# Altium project Power_electronics_FULL.PrjPcb
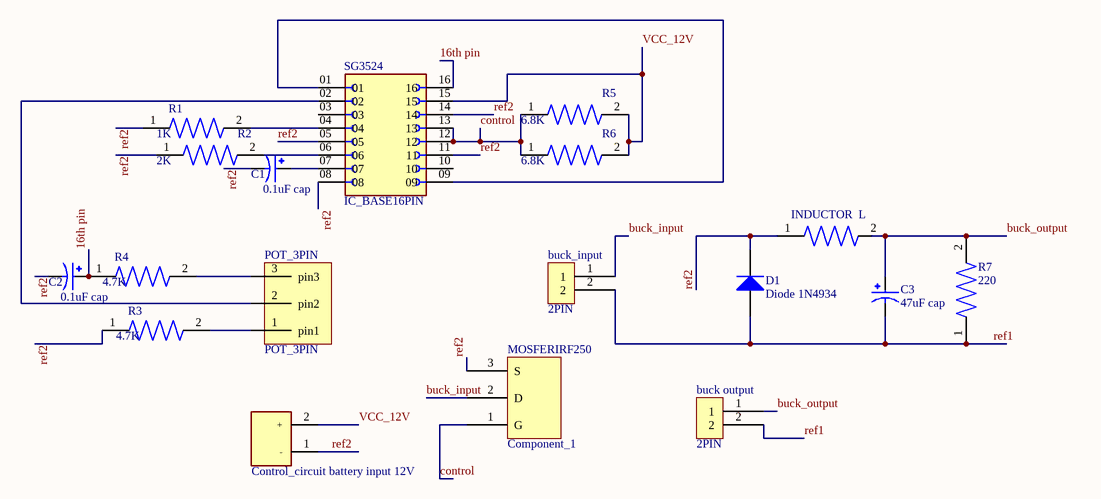
[diagram p0: PE.SchDoc]
2 sheets, 41 parts. Net scope: global (net labels, ports and power ports of the same name join across sheets).
Board files: PE.PcbDoc, CHARGER.PcbDoc
Sheets:
  PE.SchDoc
  CHARGER.SchDoc

## Sheet PE.SchDoc
size A; SheetNumber: 1; SheetTotal: 1

### Parts
buck_input  2PIN  [pin2]
buck_output  2PIN  [pin2]
C1  0.1uF cap  [4.7UF CAP]
C2  0.1uF cap  [4.7UF CAP]
C3  47uF cap  [4.7UF CAP]
Control_circuit_battery_input_12V  HEADER, 2 PINS  [XT60 MALE]  (value not drawn)
D1  Diode 1N4934  [DO-41]
L  INDUCTOR  [RESAD700W45L350D185]
MOSFERIRF250  Component_1  [mosfetIRF250]
POT_3PIN  POT_3PIN  [pot_3pin]
R1  1K  [RESAD700W45L350D185]
R2  2K  [RESAD700W45L350D185]
R3  4.7K  [RESAD700W45L350D185]
R4  4.7K  [RESAD700W45L350D185]
R5  6.8K  [RESAD700W45L350D185]
R6  6.8K  [RESAD700W45L350D185]
R7  220  [RESAD700W45L350D185]
SG3524  IC_BASE16PIN  [AMPHENOL_DILB16P-223TLF]

### Nets
16th pin: C2.P R4.1 SG3524.16
buck_input: buck_input.1 MOSFERIRF250.2(D)
buck_output: buck_output.1 C3.P L.2 R7.2
control : MOSFERIRF250.1(G) R5.1 R6.1 SG3524.12 SG3524.13
ref1: buck_input.2 buck_output.2 C3.N D1.1(A) R7.1
ref2: C1.N C2.N Control_circuit_battery_input_12V.1(-) D1.2(K) L.1 MOSFERIRF250.3(S) R1.1 R2.1 R3.1 SG3524.05 SG3524.08 SG3524.11 SG3524.14
VCC_12V: Control_circuit_battery_input_12V.2(+) R5.2 R6.2 SG3524.15
NetC1_P: C1.P SG3524.07
NetPOT_3PIN_1: POT_3PIN.1(pin1) R3.2
NetPOT_3PIN_2: POT_3PIN.2(pin2) SG3524.02
NetPOT_3PIN_3: POT_3PIN.3(pin3) R4.2
NetR1_2: R1.2 SG3524.04
NetR2_2: R2.2 SG3524.06
NetSG3524_01: SG3524.01 SG3524.09

Not connected (* = marked no-connect by the designer): SG3524 03 10

### Library data of the parts
C1-C3 = 4.7uF cap: CAP ALUM 4.7UF 20% 50V RADIAL; MP: ECE-A1HKA4R7I; MF: Panasonic; Purchase-URL: https://pricing.snapeda.com/search/part/ECE-A1HKA4R7I/?ref=eda; Package: RADIAL-2 Panasonic; Value: *; SnapEDA_Link: https://www.snapeda.com/parts/ECE-A1HKA4R7I/Panasonic/view-part/2342017/?ref=snap; Availability: In Stock; Price: None; Check_prices: https://www.snapeda.com/parts/ECE-A1HKA4R7I/Panasonic/view-part/2342017/?ref=eda
Control_circuit_battery_input_12V = XT60 MALE: CONNECTOR
D1 = Diode 1N4934: 1 Amp Fast Recovery Rectifier; Published: 8-Jun-2000; LatestRevisionDate: 17-Jul-2002; LatestRevisionNote: Re-released for DXP Platform.; DatasheetVersion: 1999; PackageVersion: Aug-1999; PackageReference: DO-41; Publisher: Altium Limited; PackageDescription: Diode, Axial; Body 5.2 x 2.7 mm (LxDia. max), Lead Dia. 0.86 mm (max); Code_JEDEC: DO-204-AL; ComponentLink1Description: Manufacturer Link; ComponentLink1URL: http://www.fairchildsemi.com/; ComponentLink2Description: Datasheet; ComponentLink2URL: http://www.fairchildsemi.com/ds/1N%2F1N4934.pdf
L R1-R7 = 3-1623927-1: 1 MOhms Â±5% 0.25W, 1/4W Through Hole Resistor Axial - Carbon Film; MF: TE Connectivity; Price: None; SnapEDA_Link: https://www.snapeda.com/parts/3-1623927-1/TE+Connectivity/view-part/?ref=snap; Check_prices: https://www.snapeda.com/parts/3-1623927-1/TE+Connectivity/view-part/?ref=eda; Value: *; MP: 3-1623927-1; Package: None; Availability: In Stock
SG3524 = IC_BASE16PIN: DIP Socket, Stamped and Formed; MF: Amphenol ICC (FCI); MP: DILB16P-223TLF; Check_prices: https://www.snapeda.com/parts/DILB16P-223TLF/Amphenol+FCI/view-part/?ref=eda; Package: None; Price: None; Value: *; SnapEDA_Link: https://www.snapeda.com/parts/DILB16P-223TLF/Amphenol+FCI/view-part/?ref=snap; Availability: In Stock

## Sheet CHARGER.SchDoc
size A; SheetNumber: 2; SheetTotal: 2
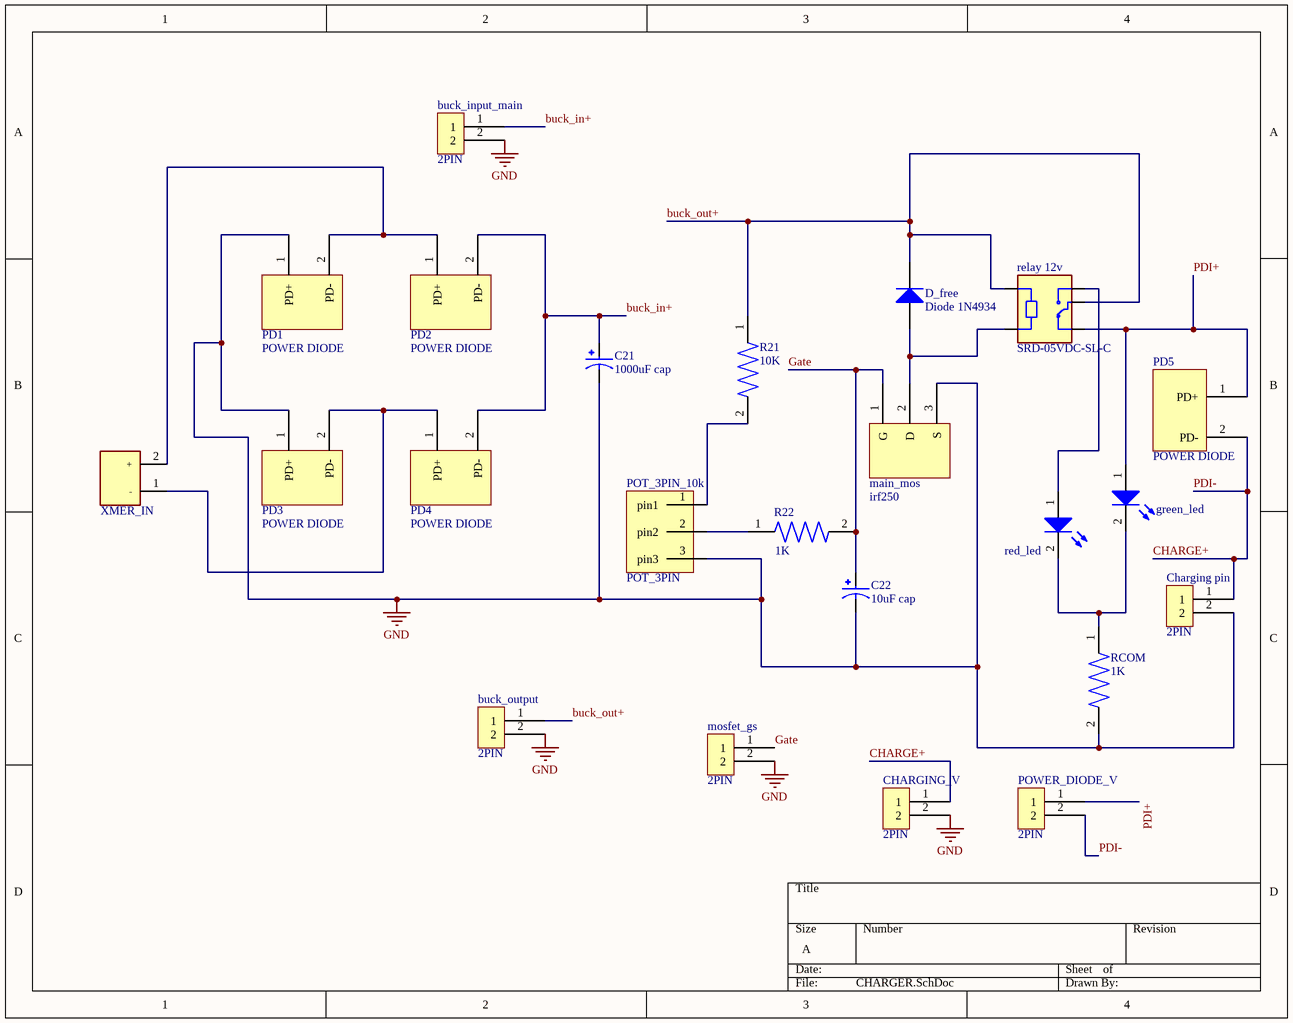
[diagram p1: CHARGER.SchDoc]

### Parts
buck_input_main  2PIN  [pin2]
buck_output  2PIN  [pin2]
C21  1000uF cap  [4.7UF CAP]
C22  10uF cap  [4.7UF CAP]
Charging_pin  2PIN  [pin2]
CHARGING_V  2PIN  [pin2]
D_free  Diode 1N4934  [DO-41]
green_led  COLOR  [led_2]  (value not drawn)
main_mos  irf250  [mosfetIRF250]
mosfet_gs  2PIN  [pin2]
PD1  POWER DIODE  [power diode]
PD2  POWER DIODE  [power diode]
PD3  POWER DIODE  [power diode]
PD4  POWER DIODE  [power diode]
PD5  POWER DIODE  [power diode]
POT_3PIN_10k  POT_3PIN  [pot_3pin]
POWER_DIODE_V  2PIN  [pin2]
R21  10K  [RESAD700W45L350D185]
R22  1K  [RESAD700W45L350D185]
RCOM  1K  [RESAD700W45L350D185]
red_led  COLOR  [led_2]  (value not drawn)
relay_12v  SRD-05VDC-SL-C  [RELAY_SRD-05VDC-SL-C]
XMER_IN  HEADER, 2 PINS  [XT60 MALE]  (value not drawn)

### Nets
GND: buck_input_main.2 buck_output.2 C21.N C22.N Charging_pin.2 CHARGING_V.2 main_mos.3(S) mosfet_gs.2 PD1.1(PD+) PD3.1(PD+) POT_3PIN_10k.3(pin3) RCOM.2
buck_in+: buck_input_main.1 C21.P PD2.2(PD-) PD4.2(PD-)
buck_out+: buck_output.1 D_free.2(K) R21.1 relay_12v.A1 relay_12v.COM
CHARGE+: Charging_pin.1 CHARGING_V.1 PD5.2(PD-) POWER_DIODE_V.2  [also labelled PDI-]
Gate: C22.P main_mos.1(G) mosfet_gs.1 R22.2
PDI+: green_led.1(A) PD5.1(PD+) POWER_DIODE_V.1 relay_12v.NC
NetD_free_1: D_free.1(A) main_mos.2(D) relay_12v.A2
Netgreen_led_2: green_led.2(K) RCOM.1 red_led.2(K)
NetPD1_2: PD1.2(PD-) PD2.1(PD+) XMER_IN.2(+)
NetPD3_2: PD3.2(PD-) PD4.1(PD+) XMER_IN.1(-)
NetPOT_3PIN_10k_1: POT_3PIN_10k.1(pin1) R21.2
NetPOT_3PIN_10k_2: POT_3PIN_10k.2(pin2) R22.1
Netred_led_1: red_led.1(A) relay_12v.NO

### Library data of the parts
C21 C22 = 4.7uF cap: as C1 on sheet PE; Purchase-URL: https://pricing.snapeda.com/search/part/ECE-A1HKA4R7I/?ref=eda; Package: RADIAL-2 Panasonic; Value: *; SnapEDA_Link: https://www.snapeda.com/parts/ECE-A1HKA4R7I/Panasonic/view-part/2342017/?ref=snap; Availability: In Stock; Price: None; Check_prices: https://www.snapeda.com/parts/ECE-A1HKA4R7I/Panasonic/view-part/2342017/?ref=eda
D_free = Diode 1N4934: 1 Amp Fast Recovery Rectifier; Published: 8-Jun-2000; LatestRevisionDate: 17-Jul-2002; LatestRevisionNote: Re-released for DXP Platform.; DatasheetVersion: 1999; PackageVersion: Aug-1999; PackageReference: DO-41; Publisher: Altium Limited; PackageDescription: Diode, Axial; Body 5.2 x 2.7 mm (LxDia. max), Lead Dia. 0.86 mm (max); Code_JEDEC: DO-204-AL; ComponentLink1Description: Manufacturer Link; ComponentLink1URL: http://www.fairchildsemi.com/; ComponentLink2Description: Datasheet; ComponentLink2URL: http://www.fairchildsemi.com/ds/1N%2F1N4934.pdf
green_led red_led = LED_2
main_mos = Component_1
R21 R22 RCOM = 3-1623927-1: as L on sheet PE; Price: None; SnapEDA_Link: https://www.snapeda.com/parts/3-1623927-1/TE+Connectivity/view-part/?ref=snap; Check_prices: https://www.snapeda.com/parts/3-1623927-1/TE+Connectivity/view-part/?ref=eda; Value: *; MP: 3-1623927-1; Package: None; Availability: In Stock
relay_12v = SRD-05VDC-SL-C: 5V Trigger Relay Module For Arduino And Raspberry Pi 5V Trigger Relay Module For Arduino And Raspberry Pi; MF: Songle Relay; Check_prices: https://www.snapeda.com/parts/SRD-05VDC-SL-C/Songle+Relay/view-part/?ref=eda; Value: *; Availability: Not in stock; Price: None; Package: NON STANDARD-5 Songle Relay; MP: SRD-05VDC-SL-C; SnapEDA_Link: https://www.snapeda.com/parts/SRD-05VDC-SL-C/Songle+Relay/view-part/?ref=snap
XMER_IN = XT60 MALE: CONNECTOR